# Altium project PCB_2.PrjPcb (part 2 of 2)

## Sheet Battery.SchDoc
size A4
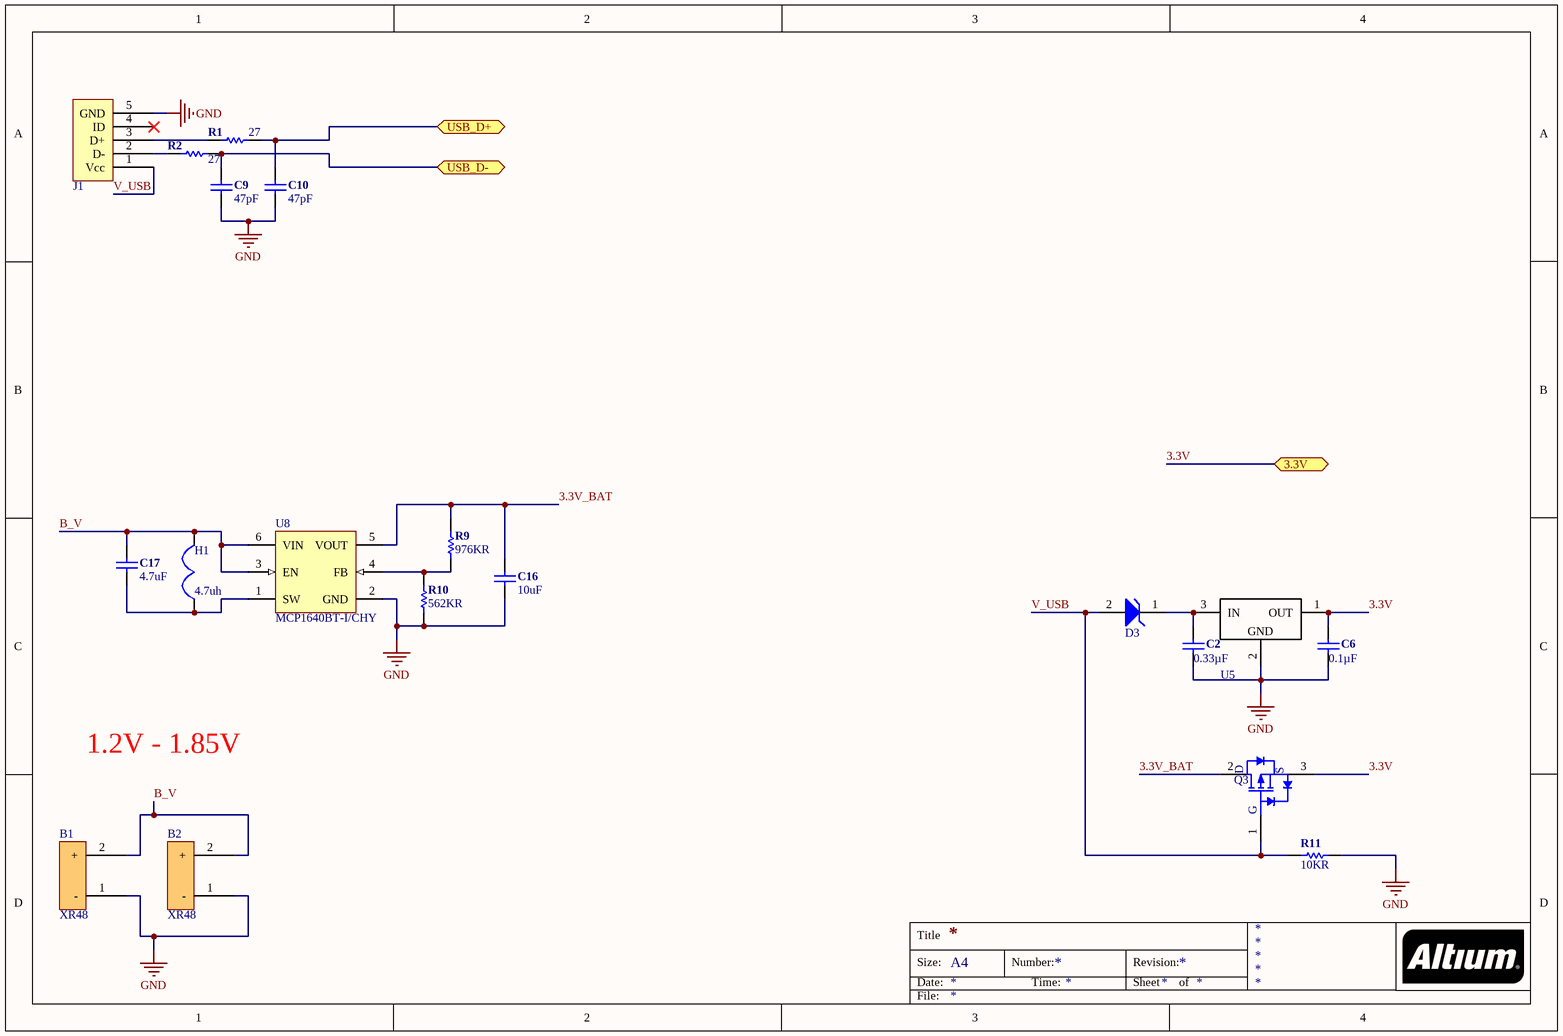
[diagram p1: Battery.SchDoc]

### Parts
B1  XR48  [XR48]
B2  XR48  [XR48]
C2  0.33µF  [CAP-0805(2012)-R]
C6  0.1µF  [CAP-0805(2012)-R]
C9  47pF  [CAP-0805(2012)-R]
C10  47pF  [CAP-0805(2012)-R]
C16  10uF  [CAP-0805(2012)-R]
C17  4.7uF  [CAP-0805(2012)-R]
D3  Shottky_Diode  [SOD-323-2]  (value not drawn)
H1  Inductance: 4.7uh  [H-0805(2012)-H]  (hidden comment: H-0805(2012))
J1  USB  [USB_Connector_5P_MICRO_USB_FCI]  (value not drawn)
Q3  DMP1045U  [SOT23-3]  (value not drawn)
R1  27  [R-0805(2012)-R]
R2  27  [R-0805(2012)-R]
R9  976KR  [R-0805(2012)-R]
R10  562KR  [R-0805(2012)-R]
R11  10KR  [R-0805(2012)-R]
U5  L78L33ACUTR  [SOT89-3]  (value not drawn)
U8  MCP1640BT-I/CHY  [MCHP-SOT-23-CHY6_L]

### Ports
3.3V, USB_D+ (bidir), USB_D- (bidir)

### Nets
GND: B1.1(-) B2.1(-) C2.2 C6.2 C9.1 C10.1 C16.2 J1.5(GND) R10.2 R11.1 U5.2(GND) U8.2(GND)
3.3V: C6.1 Q3.3(S) U5.1(OUT) ; port 3.3V
3.3V_BAT: C16.1 Q3.2(D) R9.1 U8.5(VOUT)
B_V: B1.2(+) B2.2(+) C17.1 H1.2 U8.3(EN) U8.6(VIN)
V_USB: D3.2(A) J1.1(Vcc) Q3.1(G) R11.2
NetC2_1: C2.1 D3.1(K) U5.3(IN)
NetC9_2: C9.2 R2.2 ; port USB_D-
NetC10_2: C10.2 R1.2 ; port USB_D+
NetC17_2: C17.2 H1.1 U8.1(SW)
NetJ1_2: J1.2(D-) R2.1
NetJ1_3: J1.3(D+) R1.1
NetR9_2: R9.2 R10.1 U8.4(FB)

Not connected (* = marked no-connect by the designer): J1 4(ID)*

### Notes on the sheet
- 1.2V - 1.85V
- Title
- Size:
- Date:
- A4
- Number:
- Time:
- Revision:
- Sheet
- of
- File:

### Library data of the parts
B1 B2 = XR48: Manufacturer: Keystone Electronics; Manufacturer Part Number: 2988; Description: RETAINER COIN CELL 7.9MM SMD; Number of Batteries: 1; Supplier 1: Digi-Key; Supplier Part Number 1: 36-2988-ND; Stock 1: 2875; Pricing 1: 1=0.42, 10=0.398, 50=0.29, 100=0.2787, 250=0.2502, 1000=0.1991, 2500=0.182, 5000=0.1706 (USD); Mount: Surface Mount,PCB; Case/Package: SMD/SMT; Package Quantity: 100; Termination: SMD/SMT; Number of Cells: 1; REACH SVHC: No SVHC; ComponentLink1URL: https://datasheet.ciiva.com/4642/m60p6-29374-4642672.pdf; ComponentLink1Description: https://datasheet.ciiva.com/4642/m60p6-29374-4642672.pdf; ComponentLink2URL: https://datasheet.ciiva.com/4/2988-4524.pdf; ComponentLink2Description: https://datasheet.ciiva.com/4/2988-4524.pdf; ComponentLink3URL: https://datasheet.ciiva.com/1390/1726104-1390366.pdf; ComponentLink3Description: https://datasheet.ciiva.com/1390/1726104-1390366.pdf
C2 = C-0805(2012): ___ OHM ___ mW 0805(2012) SMD; Manufacturer: Yageo; Manufacturer Part Number: CC0805KKX7R7BB334; Tolerance: ±10%; Voltage - Rated: 16V; Temperature Coefficient: X7R; Supplier 1: Digi-Key; Supplier Part Number 1: 311-1882-1-ND; RoHS: RoHS Compliant; Category: Capacitors; Stock 1: 5738; Pricing 1: 1=0.19, 10=0.129, 25=0.0948, 50=0.0776, 100=0.0655, 250=0.05344, 500=0.04482, 1000=0.03965 (USD); Packaging: Cut Tape (CT); Part Status: Active; Capacitance: 0.33µF; Operating Temperature: -55°C ~ 125°C; Features: -; Ratings: -; Applications: General Purpose; Failure Rate: -; Mounting Type: Surface Mount, MLCC; Package / Case: 0805 (2012 Metric); Size / Dimension: 0.079" L x 0.049" W (2.00mm x 1.25mm); Height - Seated (Max): -; Thickness (Max): 0.057" (1.45mm); Lead Spacing: -; Lead Style: -; ComponentLink1URL: http://www.yageo.com/documents/recent/UPY-GPHC_X7R_6.3V-to-50V_16.pdf; ComponentLink1Description: http://www.yageo.com/documents/recent/UPY-GPHC_X7R_6.3V-to-50V_16.pdf
C6 = C-0805(2012): ___ OHM ___ mW 0805(2012) SMD; Manufacturer: Yageo; Manufacturer Part Number: CC0805KRX7R9BB104; Tolerance: ±10%; Voltage - Rated: 50V; Temperature Coefficient: X7R; Supplier 1: Digi-Key; Supplier Part Number 1: 311-1140-1-ND; RoHS: RoHS Compliant; Category: Capacitors; Stock 1: 1673292; Pricing 1: 1=0.1, 10=0.052, 25=0.0376, 50=0.0282, 100=0.023, 250=0.01928, 500=0.01646, 1000=0.01294 (USD); Packaging: Cut Tape (CT); Part Status: Active; Capacitance: 0.1µF; Operating Temperature: -55°C ~ 125°C; Features: -; Ratings: -; Applications: General Purpose; Failure Rate: -; Mounting Type: Surface Mount, MLCC; Package / Case: 0805 (2012 Metric); Size / Dimension: 0.079" L x 0.049" W (2.00mm x 1.25mm); Height - Seated (Max): -; Thickness (Max): 0.033" (0.85mm); Lead Spacing: -; Lead Style: -; ComponentLink1URL: http://www.yageo.com/documents/recent/UPY-GPHC_X7R_6.3V-to-50V_16.pdf; ComponentLink1Description: http://www.yageo.com/documents/recent/UPY-GPHC_X7R_6.3V-to-50V_16.pdf
C9 C10 = C-0805(2012): ___ OHM ___ mW 0805(2012) SMD; Manufacturer: Yageo; Manufacturer Part Number: CC0805JRNPO9BN470; Tolerance: ±5%; Voltage - Rated: 50V; Temperature Coefficient: C0G, NP0; Supplier 1: Digi-Key; Supplier Part Number 1: 311-1107-1-ND; RoHS: RoHS Compliant; Category: Capacitors; Stock 1: 181638; Pricing 1: 1=0.1, 10=0.055, 25=0.0396, 50=0.0298, 100=0.0243, 250=0.02032, 500=0.01734, 1000=0.01363 (USD); Packaging: Cut Tape (CT); Part Status: Active; Capacitance: 47pF; Operating Temperature: -55°C ~ 125°C; Features: -; Ratings: -; Applications: General Purpose; Failure Rate: -; Mounting Type: Surface Mount, MLCC; Package / Case: 0805 (2012 Metric); Size / Dimension: 0.079" L x 0.049" W (2.00mm x 1.25mm); Height - Seated (Max): -; Thickness (Max): 0.024" (0.60mm); Lead Spacing: -; Lead Style: -; ComponentLink1URL: http://www.yageo.com/NewPortal/yageodocoutput?fileName=/pdf/MLCC/UPY-GP_NP0_16V-to-50V_14.pdf; ComponentLink1Description: http://www.yageo.com/NewPortal/yageodocoutput?fileName=/pdf/MLCC/UPY-GP_NP0_16V-to-50V_14.pdf
C16 = C-0805(2012): ___ OHM ___ mW 0805(2012) SMD; Manufacturer: Murata; Manufacturer Part Number: GRM219R61A106KE44D; Material: Ceramic; Voltage Rating: 10V; Tolerance: 10%; Dielectric: X5R; Supplier 1: Mouser; Supplier Part Number 1: 81-GRM219R61A106KE4D; Stock 1: 105901; Pricing 1: 1=0.2, 10=0.084, 50=0.084, 100=0.057, 1000=0.043, 10000=0.03 (USD); Mount: Surface Mount; Case/Package: 0805; Case Code (Metric): 2012; Case Code (Imperial): 0805; Min Operating Temperature: -55°C; Max Operating Temperature: 85°C; Package Quantity: 1; Capacitance: 10uF; Packaging: Tape and Reel; Voltage Rating (DC): 10V; Termination: SMD/SMT; Voltage: 10V; Length: 2mm; Height: 0.85mm; Width: 1.25mm; Thickness: 0.037inch; Depth: 1.25mm; Radiation Hardening: No; REACH SVHC: No SVHC; Lead Free: Lead Free; ComponentLink1URL: https://datasheet.ciiva.com/172/grm219r61a106ke44-01-172352.pdf; ComponentLink1Description: https://datasheet.ciiva.com/172/grm219r61a106ke44-01-172352.pdf; ComponentLink2URL: https://datasheet.ciiva.com/172/grm219r61a106ke44-01-172353.pdf; ComponentLink2Description: https://datasheet.ciiva.com/172/grm219r61a106ke44-01-172353.pdf; ComponentLink3URL: https://datasheet.ciiva.com/172/grm219r61a106ke44-01-172354.pdf; ComponentLink3Description: https://datasheet.ciiva.com/172/grm219r61a106ke44-01-172354.pdf; ComponentLink4URL: https://datasheet.ciiva.com/5414/product-5414357.pdf; ComponentLink4Description: https://datasheet.ciiva.com/5414/product-5414357.pdf; ComponentLink5URL: https://datasheet.ciiva.com/3777/54grm219r61a106ke4423-3777910.pdf; ComponentLink5Description: https://datasheet.ciiva.com/3777/54grm219r61a106ke4423-3777910.pdf; ComponentLink6URL: https://datasheet.ciiva.com/7719/c02e-7719062.pdf; ComponentLink6Description: https://datasheet.ciiva.com/7719/c02e-7719062.pdf; ComponentLink7URL: https://datasheet.ciiva.com/2989/product-2989663.pdf; ComponentLink7Description: https://datasheet.ciiva.com/2989/product-2989663.pdf; ComponentLink8URL: https://datasheet.ciiva.com/17451/product-17451791.pdf; ComponentLink8Description: https://datasheet.ciiva.com/17451/product-17451791.pdf
C17 = C-0805(2012): ___ OHM ___ mW 0805(2012) SMD; Manufacturer: Murata; Manufacturer Part Number: GRM21BR61C475KA88L; Tolerance: 10%; Voltage Rating: 16V; Dielectric: X5R; Supplier 1: Mouser; Supplier Part Number 1: 81-GRM21BR61C475KA8L; Stock 1: 95997; Pricing 1: 1=0.2, 10=0.076, 50=0.076, 100=0.053, 1000=0.037, 10000=0.027 (USD); Mount: Surface Mount; Case/Package: 0805; Case Code (Imperial): 0805; Case Code (Metric): 2012; Min Operating Temperature: -55°C; Max Operating Temperature: 85°C; Packaging: Tape and Reel; Capacitance: 4.7uF; Voltage Rating (DC): 16V; Package Quantity: 1; Termination: SMD/SMT; Voltage: 16V; Length: 2mm; Height: 1.25mm; Width: 1.25mm; Thickness: 0.053inch; Depth: 1.25mm; Radiation Hardening: No; REACH SVHC: No SVHC; Lead Free: Lead Free; ComponentLink1URL: https://datasheet.ciiva.com/2989/product-2989699.pdf; ComponentLink1Description: https://datasheet.ciiva.com/2989/product-2989699.pdf; ComponentLink2URL: https://datasheet.ciiva.com/2989/product-2989700.pdf; ComponentLink2Description: https://datasheet.ciiva.com/2989/product-2989700.pdf; ComponentLink3URL: https://datasheet.ciiva.com/16199/product-16199957.pdf; ComponentLink3Description: https://datasheet.ciiva.com/16199/product-16199957.pdf; ComponentLink4URL: https://datasheet.ciiva.com/16624/product-16624469.pdf; ComponentLink4Description: https://datasheet.ciiva.com/16624/product-16624469.pdf; ComponentLink5URL: https://datasheet.ciiva.com/22706/608985-22706821.pdf; ComponentLink5Description: https://datasheet.ciiva.com/22706/608985-22706821.pdf; ComponentLink6URL: https://datasheet.ciiva.com/3777/grm21br61c475ka8823-3777176.pdf; ComponentLink6Description: https://datasheet.ciiva.com/3777/grm21br61c475ka8823-3777176.pdf; ComponentLink7URL: https://datasheet.ciiva.com/137/product-137674.pdf; ComponentLink7Description: https://datasheet.ciiva.com/137/product-137674.pdf; ComponentLink8URL: https://datasheet.ciiva.com/137/product-137675.pdf; ComponentLink8Description: https://datasheet.ciiva.com/137/product-137675.pdf; ComponentLink9URL: https://datasheet.ciiva.com/137/product-137676.pdf; ComponentLink9Description: https://datasheet.ciiva.com/137/product-137676.pdf
D3 = Shottky_Diode: BAT60AE6327HTSA1; Manufacturer: Infineon; Forward Voltage: 370mV; Forward Current: 3A; Reverse Voltage (DC): 10V; Peak Non-Repetitive Surge Current: 5A; Element Configuration: Single; Polarity: Standard; Supplier 1: Mouser; Manufacturer Part Number: BAT60AE6327HTSA1; Stock 1: 7383; Pricing 1: 1=0.42, 10=0.29, 50=0.29, 100=0.133, 1000=0.103, 10000=0.087 (USD); Mount: Surface Mount; Number of Pins: 2; Contact Plating: Tin; Min Operating Temperature: -55°C; Max Operating Temperature: 85°C; Packaging: Tape and Reel; Average Rectified Current: 3A; Max Repetitive Reverse Voltage (Vrrm): 10V; Voltage Rating (DC): 10V; Current Rating: 3A; Output Current: 3A; Radiation Hardening: No; REACH SVHC: No SVHC; Lead Free: Lead Free; ComponentLink1URL: https://datasheet.ciiva.com/8300/infineon-bat60aseries-ds-v01-01-en-8300325.pdf; ComponentLink1Description: https://datasheet.ciiva.com/8300/infineon-bat60aseries-ds-v01-01-en-8300325.pdf; ComponentLink2URL: https://datasheet.ciiva.com/26948/getdatasheetpartid-743048-26948826.pdf; ComponentLink2Description: https://datasheet.ciiva.com/26948/getdatasheetpartid-743048-26948826.pdf; Supplier Part Number 1: 726-BAT60AE6327
H1 = H-0805(2012): Manufacturer: TDK; Manufacturer Part Number: MLP2012S4R7MT0S1; Core Material: Ferrite; Tolerance: 20%; Current Rating: 700mA; Shielding: Shielded; DC Resistance (DCR): 260mR; Test Frequency: 2MHz; Supplier 1: Mouser; Supplier Part Number 1: 810-MLP2012S4R7MT0S1; Stock 1: 5251; Pricing 1: 1=0.36, 10=0.254, 50=0.254, 100=0.236, 1000=0.167, 10000=0.112 (USD); Case/Package: 0805; Case Code (Metric): 2012; Case Code (Imperial): 0805; Min Operating Temperature: -40°C; Max Operating Temperature: 125°C; Package Quantity: 4000; Packaging: Tape and Reel; Length: 0.079inch; Width: 0.049inch; Height - Seated (Max): 0.039inch; ComponentLink1URL: https://datasheet.ciiva.com/41798/inductor-commercial-power-mlp-en-41798601.pdf; ComponentLink1Description: https://datasheet.ciiva.com/41798/inductor-commercial-power-mlp-en-41798601.pdf
J1 = USB: USB_Connector_5P_MICRO_USB_FCI; Manufacturer: Amphenol FCI; Manufacturer Part Number: 10118194-0001LF; Connector Type: USB - micro B; Current Rating: 1.8A per Contact; Gender: Receptacle; Number of Contacts: 5; Specifications: USB 2.0; Number of Ports: 1; Voltage - Rated: 100VAC; Mating Cycles: 10000; Shielding: Shielded; Material Flammability Rating: UL94 V-0; Supplier 1: Digi-Key; RoHS: RoHS Compliant; Category: Connectors, Interconnects; Stock 1: 267893; Pricing 1: 1=0.46, 10=0.437, 25=0.3744, 50=0.318, 100=0.3056, 250=0.27444, 500=0.26196 (USD); Packaging: Cut Tape (CT); ComponentLink1URL: http://portal.fciconnect.com/Comergent//fci/drawing/10118194.pdf; ComponentLink1Description: http://portal.fciconnect.com/Comergent//fci/drawing/10118194.pdf; Supplier Part Number 1: 609-4618-1-ND; Part Status: Active; Mounting Type: Surface Mount, Right Angle; Through Hole; Mounting Feature: Horizontal; Termination: Solder; Features: Solder Retention; Ingress Protection: -; Operating Temperature: -30°C ~ 80°C; Contact Finish: Gold; Shell/Shielding Material: Steel, Stainless; Insulation Color: Black
Q3 = DMP1045U: Manufacturer: Diodes; Manufacturer Part Number: DMP1045U-7; Rise Time: 23.3ns; Rds On Max: 31mR; Input Capacitance: 1.357nF; Continuous Drain Current (ID): 4A; Drain to Source Voltage (Vdss): 12V; Max Power Dissipation: 800mW; Gate to Source Voltage (Vgs): 8V; Fall Time: 106.9ns; Turn-Off Delay Time: 91.2ns; Turn-On Delay Time: 15.7ns; Number of Elements: 1; Power Dissipation: 1.3W; Element Configuration: Single; Drain to Source Breakdown Voltage: -12V; Supplier 1: Mouser; Stock 1: 5719; Pricing 1: 1=0.43, 10=0.298, 50=0.298, 100=0.137, 1000=0.105, 10000=0.082 (USD); Mount: Surface Mount; Case/Package: SOT-23; Number of Pins: 3; Weight: 0.000282oz; Contact Plating: Tin; Min Operating Temperature: -55°C; Max Operating Temperature: 150°C; Package Quantity: 3000; Packaging: Tape and Reel; Drain to Source Resistance: 31mR; Number of Channels: 1; Length: 3mm; Height: 1.1mm; Width: 1.4mm; Radiation Hardening: No; REACH SVHC: No SVHC; Lead Free: Lead Free; ComponentLink1URL: https://datasheet.ciiva.com/11176/dmp1045u-11176581.pdf; ComponentLink1Description: https://datasheet.ciiva.com/11176/dmp1045u-11176581.pdf; ComponentLink2URL: https://datasheet.ciiva.com/17323/dmp1045u-17323644.pdf; ComponentLink2Description: https://datasheet.ciiva.com/17323/dmp1045u-17323644.pdf; ComponentLink3URL: https://datasheet.ciiva.com/18648/dmp1045u-18648300.pdf; ComponentLink3Description: https://datasheet.ciiva.com/18648/dmp1045u-18648300.pdf; Supplier Part Number 1: 621-DMP1045U-7
R1 R2 = R-0805(2012): ___ OHM ___ mW 0805(2012) SMD; Manufacturer: Yageo; Manufacturer Part Number: RC0805JR-0727RL; Tolerance: ±5%; Power (Watts): 0.125W, 1/8W; Temperature Coefficient: ±100ppm/°C; Supplier 1: Digi-Key; Supplier Part Number 1: 311-27ARCT-ND; RoHS: RoHS Compliant; Category: Resistors; Stock 1: 89837; Pricing 1: 1=0.1, 10=0.016, 25=0.0116, 50=0.009, 100=0.0066, 250=0.00504, 500=0.00404, 1000=0.00297 (USD); Packaging: Cut Tape (CT); Part Status: Active; Resistance (Ohms): 27; Composition: Thick Film; Features: Moisture Resistant; Operating Temperature: -55°C ~ 155°C; Package / Case: 0805 (2012 Metric); Supplier Device Package: 0805; Size / Dimension: 0.079" L x 0.049" W (2.00mm x 1.25mm); Height - Seated (Max): 0.024" (0.60mm); Failure Rate: -; ComponentLink1URL: http://www.yageo.com/documents/recent/PYu-RC_Group_51_RoHS_L_7.pdf; ComponentLink1Description: http://www.yageo.com/documents/recent/PYu-RC_Group_51_RoHS_L_7.pdf
R9 = R-0805(2012): ___ OHM ___ mW 0805(2012) SMD; Manufacturer: Panasonic ECG; Manufacturer Part Number: ERJ-6ENF9763V; Power Rating: 125mW; Tolerance: 1%; Voltage Rating: 150V; Temperature Coefficient: 100ppm/°C; Supplier 1: Mouser; Supplier Part Number 1: 667-ERJ-6ENF9763V; Stock 1: 48708; Pricing 1: 1=0.1, 10=0.022, 50=0.022, 100=0.009, 1000=0.007, 10000=0.004 (USD); Mount: Surface Mount; Case/Package: 0805; Case Code (Metric): 2012; Case Code (Imperial): 0805; Contact Plating: Tin; Min Operating Temperature: -55°C; Max Operating Temperature: 155°C; Resistance: 976KR; Packaging: Tape and Reel; Package Quantity: 1; Composition: Thick Film; Number of Terminations: 2; Termination: SMD/SMT; Max Power Dissipation: 125mW; Voltage Rating (DC): 150V; Length: 2mm; Height: 0.6mm; Width: 0.049inch; Depth: 1.25mm; REACH SVHC: Yes; Lead Free: Lead Free; ComponentLink1URL: https://datasheet.ciiva.com/16776/70260748-16776101.pdf; ComponentLink1Description: https://datasheet.ciiva.com/16776/70260748-16776101.pdf; ComponentLink2URL: https://datasheet.ciiva.com/9179/aoa0000ce2-9179366.pdf; ComponentLink2Description: https://datasheet.ciiva.com/9179/aoa0000ce2-9179366.pdf; ComponentLink3URL: https://datasheet.ciiva.com/16758/70260748-16758678.pdf; ComponentLink3Description: https://datasheet.ciiva.com/16758/70260748-16758678.pdf; ComponentLink4URL: https://datasheet.ciiva.com/46438/1678782-46438408.pdf; ComponentLink4Description: https://datasheet.ciiva.com/46438/1678782-46438408.pdf; ComponentLink5URL: https://datasheet.ciiva.com/22668/1678782-22668460.pdf; ComponentLink5Description: https://datasheet.ciiva.com/22668/1678782-22668460.pdf
R10 = R-0805(2012): ___ OHM ___ mW 0805(2012) SMD; Manufacturer: Vishay; Manufacturer Part Number: CRCW0805562KFKEA; Power Rating: 125mW; Tolerance: 1%; Voltage Rating: 150V; Temperature Coefficient: 100ppm/°C; Supplier 1: Mouser; Supplier Part Number 1: 71-CRCW0805-562K-E3; Stock 1: 9712; Pricing 1: 1=0.1, 10=0.049, 50=0.049, 100=0.028, 1000=0.019, 10000=0.007 (USD); Case/Package: 0805; Number of Pins: 2; Weight: 0.000194oz; Case Code (Imperial): 0805; Case Code (Metric): 2012; Contact Plating: Tin; Min Operating Temperature: -55°C; Max Operating Temperature: 155°C; Resistance: 562KR; Packaging: Tape and Reel; Package Quantity: 10; Composition: Thick Film; Number of Terminations: 2; Military Standard: Not; Max Power Dissipation: 125mW; Length: 2mm; Height: 0.02inch; Width: 1.25mm; Depth: 1.25mm; Radiation Hardening: No; REACH SVHC: Unknown; ComponentLink1URL: https://datasheet.ciiva.com/22706/1697337-22706277.pdf; ComponentLink1Description: https://datasheet.ciiva.com/22706/1697337-22706277.pdf; ComponentLink2URL: https://datasheet.ciiva.com/2525/dcrcwe3-2525767.pdf; ComponentLink2Description: https://datasheet.ciiva.com/2525/dcrcwe3-2525767.pdf; ComponentLink3URL: https://datasheet.ciiva.com/2525/dcrcwe3-2525768.pdf; ComponentLink3Description: https://datasheet.ciiva.com/2525/dcrcwe3-2525768.pdf; ComponentLink4URL: https://datasheet.ciiva.com/2525/dcrcwe3-2525769.pdf; ComponentLink4Description: https://datasheet.ciiva.com/2525/dcrcwe3-2525769.pdf; ComponentLink5URL: https://datasheet.ciiva.com/8928/dcrcwe3-8928345.pdf; ComponentLink5Description: https://datasheet.ciiva.com/8928/dcrcwe3-8928345.pdf; ComponentLink6URL: https://datasheet.ciiva.com/17160/dcrcwe3-17160041.pdf; ComponentLink6Description: https://datasheet.ciiva.com/17160/dcrcwe3-17160041.pdf; ComponentLink7URL: https://datasheet.ciiva.com/22674/1847332-22674793.pdf; ComponentLink7Description: https://datasheet.ciiva.com/22674/1847332-22674793.pdf; ComponentLink8URL: https://datasheet.ciiva.com/7670/1697337-7670907.pdf; ComponentLink8Description: https://datasheet.ciiva.com/7670/1697337-7670907.pdf; ComponentLink9URL: https://datasheet.ciiva.com/7670/1697337-7670908.pdf; ComponentLink9Description: https://datasheet.ciiva.com/7670/1697337-7670908.pdf; ComponentLink10URL: https://datasheet.ciiva.com/16204/dcrcwe3-16204271.pdf; ComponentLink10Description: https://datasheet.ciiva.com/16204/dcrcwe3-16204271.pdf
R11 = R-0805(2012): ___ OHM ___ mW 0805(2012) SMD; Manufacturer: Yageo; Manufacturer Part Number: RC0805FR-0710KL; Tolerance: 1%; Temperature Coefficient: 100ppm/°C; Power Rating: 125mW; Voltage Rating: 150V; Supplier 1: Mouser; Supplier Part Number 1: 603-RC0805FR-0710KL; Stock 1: 1634514; Pricing 1: 1=0.1, 10=0.016, 50=0.016, 100=0.006, 1000=0.004, 10000=0.003 (USD); Case/Package: 0805; Case Code (Imperial): 0805; Case Code (Metric): 2012; Min Operating Temperature: -55°C; Max Operating Temperature: 155°C; Packaging: Tape and Reel; Resistance: 10KR; Composition: Thick Film; Package Quantity: 1; Termination: SMD/SMT; Number of Terminations: 2; Military Standard: Not; Max Power Dissipation: 125mW; Length: 2mm; Height: 0.024inch; Width: 0.049inch; Depth: 1.25mm; REACH SVHC: Unknown; Lead Free: Lead Free; ComponentLink1URL: https://datasheet.ciiva.com/11808/0900766b8106beab-11808151.pdf; ComponentLink1Description: https://datasheet.ciiva.com/11808/0900766b8106beab-11808151.pdf; ComponentLink2URL: https://datasheet.ciiva.com/12669/rc0805-12669688.pdf; ComponentLink2Description: https://datasheet.ciiva.com/12669/rc0805-12669688.pdf; ComponentLink3URL: https://datasheet.ciiva.com/46447/444164-46447563.pdf; ComponentLink3Description: https://datasheet.ciiva.com/46447/444164-46447563.pdf; ComponentLink4URL: https://datasheet.ciiva.com/2456/pyu-r-int-thick-7-2456972.pdf; ComponentLink4Description: https://datasheet.ciiva.com/2456/pyu-r-int-thick-7-2456972.pdf; ComponentLink5URL: https://datasheet.ciiva.com/2456/pyu-r-int-thick-7-2456973.pdf; ComponentLink5Description: https://datasheet.ciiva.com/2456/pyu-r-int-thick-7-2456973.pdf; ComponentLink6URL: https://datasheet.ciiva.com/2456/pyu-r-int-thick-7-2456974.pdf; ComponentLink6Description: https://datasheet.ciiva.com/2456/pyu-r-int-thick-7-2456974.pdf; ComponentLink7URL: https://datasheet.ciiva.com/16747/rc0805-16747087.pdf; ComponentLink7Description: https://datasheet.ciiva.com/16747/rc0805-16747087.pdf
U5 = L78L33ACUTR: Manufacturer: STMicroelectronics; Number of Outputs: 1; Output Voltage: 3.3V; Max Input Voltage: 30V; Max Output Current: 100mA; Polarity: Positive; Quiescent Current: 6mA; Accuracy: 4%; Dropout Voltage: 1.7V; Min Input Voltage: 5.3V; Power Supply Rejection Ratio (PSRR): 49dB; Supplier 1: Mouser; Supplier Part Number 1: 511-L78L33ACU; Manufacturer Part Number: L78L33ACUTR; Stock 1: 36473; Pricing 1: 1=0.42, 10=0.319, 50=0.319, 100=0.173, 1000=0.13, 10000=0.105 (USD); Mount: Surface Mount; Case/Package: SOT-89; Number of Pins: 3; Weight: 0.01lb; Min Operating Temperature: 0°C; Max Operating Temperature: 125°C; Packaging: Tape and Reel; Output Current: 100mA; Package Quantity: 2500; Nominal Output Voltage: 3.3V; Number of Regulators: 1; Min Output Voltage: 3.3V; Output Voltage Accuracy: 4%; Length: 4.6mm; Height: 1.6mm; Width: 2.6mm; Radiation Hardening: No; REACH SVHC: No SVHC; Lead Free: Lead Free; ComponentLink7URL: https://datasheet.ciiva.com/41439/001184652-da-01-en-ic-reg-ldo-3-3v-l78l33acutr-sot-89-3-stm-41439755.pdf; ComponentLink7Description: https://datasheet.ciiva.com/41439/001184652-da-01-en-ic-reg-ldo-3-3v-l78l33acutr-sot-89-3-stm-41439755.pdf
U8 = CMP-0139-00285-1: Start-up Synchronous Boost Regulator with True Output Disconnect or Input / Output Bypass Option, 350 mA, Input Voltage 0.65 to 5.5 V, Output Voltage 2.0 to 5.5 V, -40 to 85 degC, 6-pin SOT-23 (CHY6), Tape and Reel; Manufacturer: Microchip; Max Supply Voltage: 5.5V; Min Supply Voltage: 650mV; Number of Outputs: 1; Output Current: 350mA; Frequency: 500KHz; Efficiency: 96%; Min Output Voltage: 2V; Supplier 1: Mouser; Supplier Part Number 1: 579-MCP1640BT-I/CHY; Manufacturer Part Number: MCP1640BT-I/CHY; Stock 1: 12237; Pricing 1: 1=0.62, 10=0.57, 50=0.48, 100=0.44, 1000=0.44, 10000=0.44 (USD); Case/Package: SOT-23; Number of Pins: 6; Contact Plating: Tin; Min Operating Temperature: -40°C; Max Operating Temperature: 85°C; Output Voltage: 5.5V; Min Input Voltage: 650mV; Packaging: Tape and Reel; Max Input Voltage: 5.5V; Switching Frequency: 500KHz; Package Quantity: 3000; Max Output Current: 350mA; Max Output Voltage: 5.5V; Length: 3.1mm; Height: 1.3mm; Width: 1.8mm; Radiation Hardening: No; REACH SVHC: No SVHC; Lead Free: Lead Free; ComponentLink1URL: https://datasheet.ciiva.com/17368/22234b-17368709.pdf; ComponentLink1Description: https://datasheet.ciiva.com/17368/22234b-17368709.pdf; ComponentLink2URL: https://datasheet.ciiva.com/7994/1669480-7994598.pdf; ComponentLink2Description: https://datasheet.ciiva.com/7994/1669480-7994598.pdf; ComponentLink3URL: https://datasheet.ciiva.com/14150/mcp1640-eng-datasheet-14150779.pdf; ComponentLink3Description: https://datasheet.ciiva.com/14150/mcp1640-eng-datasheet-14150779.pdf; ComponentLink4URL: https://datasheet.ciiva.com/22711/1669480-22711102.pdf; ComponentLink4Description: https://datasheet.ciiva.com/22711/1669480-22711102.pdf; ComponentLink5URL: https://datasheet.ciiva.com/29305/651405-da-01-en-ic-reg-mcp1640bt-i-chy-sot-23-6-mcp-29305435.pdf; ComponentLink5Description: https://datasheet.ciiva.com/29305/651405-da-01-en-ic-reg-mcp1640bt-i-chy-sot-23-6-mcp-29305435.pdf

## Nets that join several sheets
GND: Sheet-2 (37 pins), Battery (12 pins)
3.3V: Sheet-2 (31 pins), Battery (C6.1 Q3.3 U5.1)
NetC9_2: Sheet-2 (U1.6), Battery (C9.2 R2.2)
NetC10_2: Sheet-2 (U1.7), Battery (C10.2 R1.2)